# EasyEDA Pro project Inductive_displacement_sensor.epro

# Schematic Schematic1
Create Date: 2023-12-21; Page Name: P1; Project Name: sensor_coil; Schematic Name: Schematic1; Update Date: 2024-03-22; Company: 嘉立创EDA; Page Size: A4; Version: V1.0
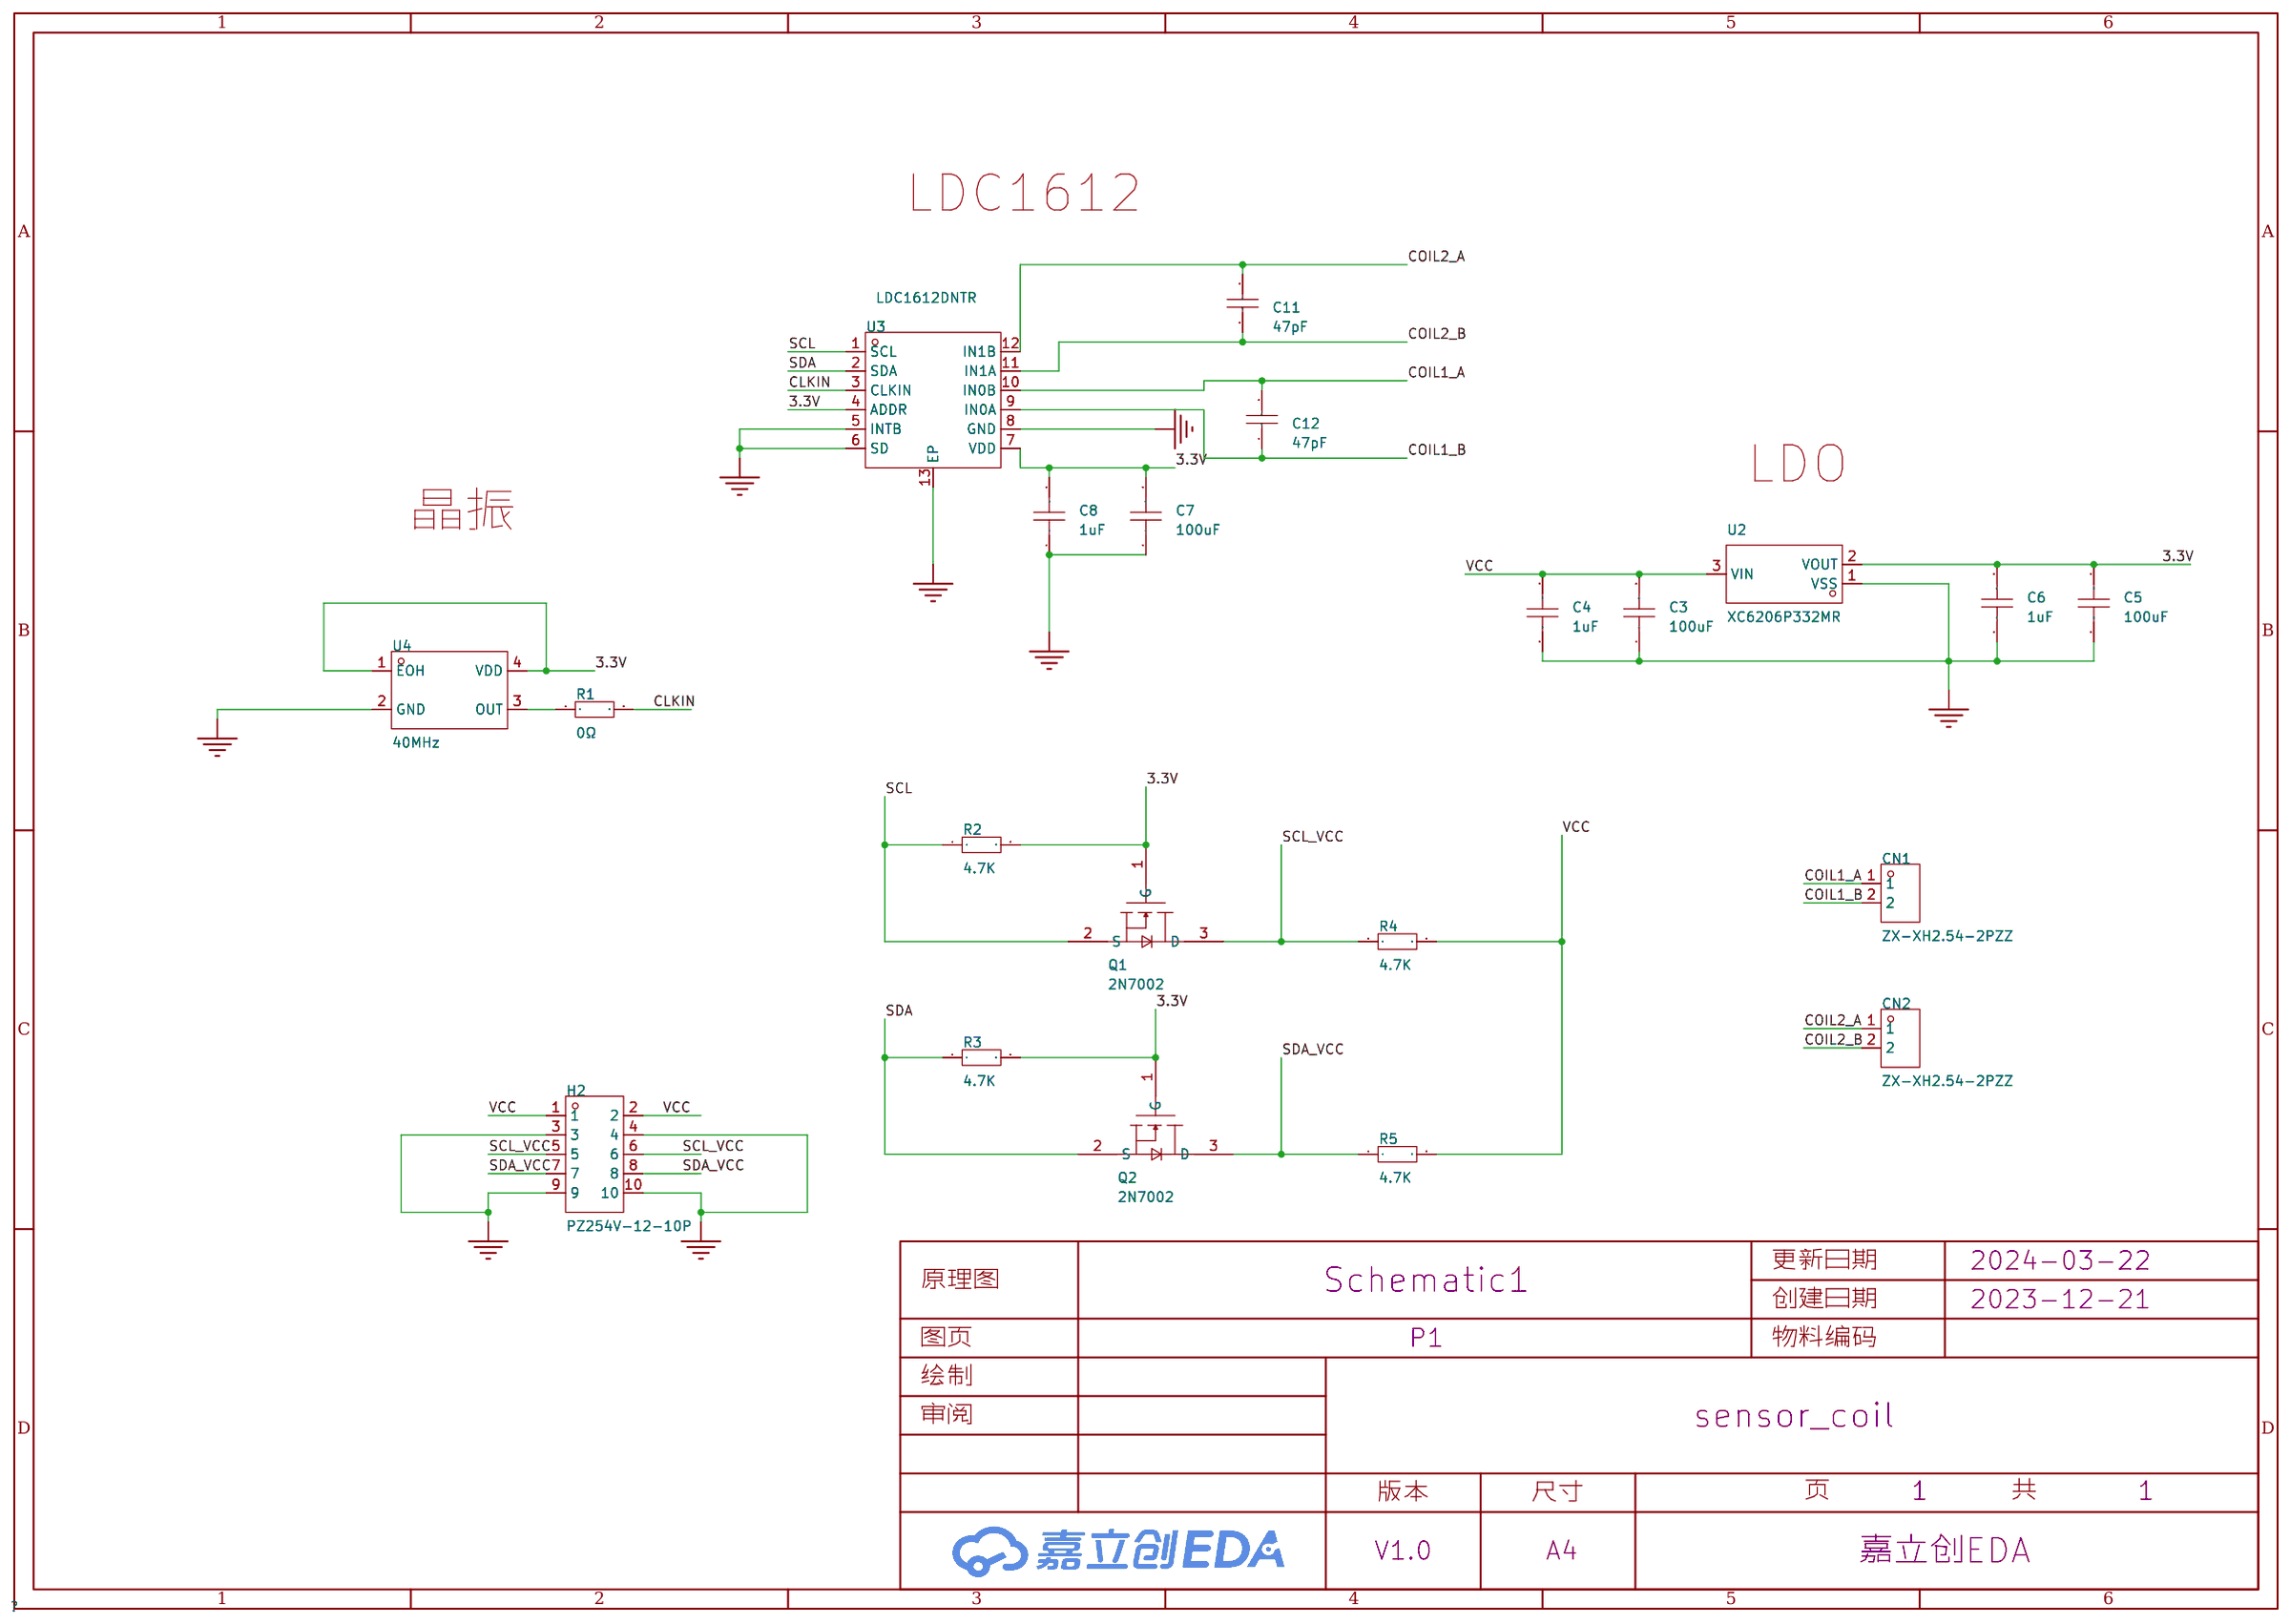
[diagram p0: schematic sheet]

## Parts
C3  100uF  [C0603]
C4  1uF  [C0603]
C5  100uF  [C0603]
C6  1uF  [C0603]
C7  100uF  [C0603]
C8  1uF  [C0603]
C11  47pF  [C0402]
C12  47pF  [C0402]
CN1  ZX-XH2.54-2PZZ  [CONN-TH_2P-P2.50_HX25003-2A]
CN2  ZX-XH2.54-2PZZ  [CONN-TH_2P-P2.50_HX25003-2A]
H2  PZ254V-12-10P  [HDR-TH_10P-P2.54-V-M-R2-C5-S2.54]
Q1  2N7002  [SOT-23-3_L2.9-W1.3-P1.90-LS2.4-BR]
Q2  2N7002  [SOT-23-3_L2.9-W1.3-P1.90-LS2.4-BR]
R1  0Ω  [R0603]
R2  4.7K  [R0603]
R3  4.7K  [R0603]
R4  4.7K  [R0603]
R5  4.7K  [R0603]
U2  XC6206P332MR  [SOT-23-3_L3.0-W1.7-P0.95-LS2.9-BR]
U3  LDC1612DNTR  [WSON-12_L4.0-W4.0-P0.50-BL-EP]
U4  40MHz  [OSC-SMD_4P-L2.5-W2.0-BL]

## Library data of the parts
C3-C8 = CAP_0603: Supplier Footprint: 0603
C11 C12 = 0402CG470J500NT: 容值:47pF;精度:±5%;额定电压:50V;材质(温度系数):C0G;; LCSC Part Name: 47pF ±5% 50V; Supplier Part: C1567; Manufacturer: FH(风华); Supplier Footprint: 0402; JLCPCB Part Class: 基础库; Datasheet: https://atta.szlcsc.com/upload/public/pdf/source/20200305/C486355_26A10D38EF8C2A5C37091D0039909270.pdf; Supplier: LCSC; Tolerance: ±5%; Voltage Rated: 50V; Temperature Coefficient: C0G
CN1 CN2 = ZX-XH2.54-2PZZ: 插针结构:1x2P;间距:2.54mm;安装方式:直插;参考系列:XH;总PIN数:2P;排数:1;每排PIN数:2;行距:-;额定电流:3A;触头材质:黄铜;触头镀层:锡;工作温度范围:-25℃~+85℃;; Supplier Part: C7429632; Manufacturer: Megastar(兆星); Supplier Footprint: 插件,P=2.54mm; JLCPCB Part Class: 扩展库; Datasheet: https://atta.szlcsc.com/upload/public/pdf/source/20230619/19BA6947230AA44A04D3EDD65E618FD0.pdf; Supplier: LCSC; Pins Structure: 1x2P; Pitch: 2.54mm; Mounting Style: 直插; Reference Series: XH; Number of Pins: 2P; Number of Rows: 1; Number of PINs Per Row: 2; Current Rating (Max): 3A; Contact Material: 黄铜; Contact Plating: 锡; Operating Temperature Range: -25℃~+85℃
H2 = PZ254V-12-10P: 插针结构:2x5P;间距:2.54mm;行距:2.54mm;圆针/方针:方针;安装类型:直插;排数:双排;总PIN位数:10P;额定电流:-;额定电压:-;配合针长度:6mm;塑高:2.5mm;端接针长度:3mm;触头材质:黄铜;触头镀层:-;工作温度范围:-40℃~+105℃;颜色:黑色;; LCSC Part Name: 间距:2.54mm 2x5P 直插 方针; Supplier Part: C492422; Manufacturer: XFCN(兴飞); Supplier Footprint: 插件,P=2.54mm; JLCPCB Part Class: 扩展库; Datasheet: https://atta.szlcsc.com/upload/public/pdf/source/20200309/C492422_5020CEA01BE7051F9EA9DD81AB0A25E3.pdf; Supplier: LCSC; Pin Structure: 2x5P; Pitch: 2.54mm; Row Spacing: 2.54mm; Circluar Pins/Square Pins: 方针; Mounting Type: 直插; Number of Rows: 双排; Number of Pins: 10P; Length of Mating Pin: 6mm; Insulation Height: 2.5mm; Length of End Connection Pin: 3mm; Contact Material: 黄铜; Operating Temperature Range: -40℃~+105℃; Color: 黑色
Q1 Q2 = 2N7002_C916396: 类型:N沟道;漏源电压(Vdss):60V;连续漏极电流(Id):115mA;功率(Pd):200mW;导通电阻(RDS(on)@Vgs,Id):1.2Ω@10V,500mA;阈值电压(Vgs(th)@Id):2.1V@250uA;; LCSC Part Name: N沟道 耐压:60V 电流:115mA; Supplier Part: C916396; Manufacturer: JSMSEMI(杰盛微); Supplier Footprint: SOT-23; JLCPCB Part Class: 扩展库; Datasheet: https://atta.szlcsc.com/upload/public/pdf/source/20230714/89F30C6A193AD72E5F1F14B53E304F4A.pdf; Supplier: LCSC; Type: N沟道; Drain Source Voltage (Vdss): 60V; Continuous Drain Current (Id): 115mA; Power Dissipation (Pd): 200mW; Drain Source On Resistance (RDS(on)@Vgs,Id): 1.2Ω@10V,500mA; Gate Threshold Voltage (Vgs(th)@Id): 2.1V@250uA; Input Capacitance (Ciss@Vds): 20pF@25V; Reverse Transfer Capacitance (Crss@Vds): 4pF@25V
R1-R5 = Res_0603: Supplier Footprint: 0603
U2 = XC6206P332MR_C347376: 输出类型:固定;最大输入电压:8V;输出电压:3.3V;最大输出电流:250mA;电源纹波抑制比(PSRR):40dB@(1kHz);输出极性:正极;; LCSC Part Name: 输入8V 输出3.3V 250mA; Supplier Part: C347376; Manufacturer: UMW(友台半导体); Supplier Footprint: SOT-23; JLCPCB Part Class: 扩展库; Datasheet: https://atta.szlcsc.com/upload/public/pdf/source/20231109/6B10DA60E52FC900BF97E3EFEB5D6341.pdf; Supplier: LCSC; Output Type: 固定; Maximum Input Voltage: 8V; Output Voltage: 3.3V; MAX Output Current: 250mA; Power Supply Rejection Ratio (PSRR): 40dB@(1kHz); Dropout Voltage: 240mV@(50mA); Operating Temperature: -25℃~+80℃; Output Polarity: 正极; Number of Outputs: 1
U3 = LDC1612DNTR: LDC1612 2 通道、28 位、高分辨率电感数字转换器; Supplier Part: C1847959; Manufacturer: TI(德州仪器); Supplier Footprint: WSON-12-EP(4x4); JLCPCB Part Class: 扩展库; Datasheet: https://www.ti.com/cn/lit/gpn/ldc1614; Supplier: LCSC
U4 = 625L3C040M00000: 频率:40MHz;输出模式:CMOS;工作电压:3.3V;供电电流:15mA;频率稳定度(全温):±50ppm;; Supplier Part: C2650709; Manufacturer: CTS(西迪斯); Supplier Footprint: SMD2520-4P; JLCPCB Part Class: 扩展库; Datasheet: https://atta.szlcsc.com/upload/public/pdf/source/20210610/B2972916CDAADDBBA22F3051322CA2A0.pdf; Supplier: LCSC; Output Type: CMOS; Supply Voltage: 3.3V; Supply Current (Max): 15mA; Frequency Stability(Full temperature range): ±50ppm; Operating Temperature: -20℃~+70℃

## Nets
3.3V: C5.2 C6.2 C7.2 C8.2 Q1.1(G) Q2.1(G) R2.2 R3.2 U2.2(VOUT) U3.4(ADDR) U3.7(VDD) U4.1(EOH) U4.4(VDD)
GND: C3.1 C4.1 C5.1 C6.1 C7.1 C8.1 H2.3 H2.4 H2.9 H2.10 U2.1(VSS) U3.5(INTB) U3.6(SD) U3.8(GND) U3.13(EP) U4.2(GND)
VCC: C3.2 C4.2 H2.1 H2.2 R4.2 R5.2 U2.3(VIN)
CLKIN: R1.2 U3.3(CLKIN)
COIL1_A: C12.2 CN1.1 U3.10(IN0B)
COIL1_B: C12.1 CN1.2 U3.9(IN0A)
COIL2_A: C11.2 CN2.1 U3.12(IN1B)
COIL2_B: C11.1 CN2.2 U3.11(IN1A)
SCL: Q1.2(S) R2.1 U3.1(SCL)
SCL_VCC: H2.5 H2.6 Q1.3(D) R4.1
SDA: Q2.2(S) R3.1 U3.2(SDA)
SDA_VCC: H2.7 H2.8 Q2.3(D) R5.1
$1N1491: R1.1 U4.3(OUT)

## Notes on the sheet
- LDC1612
- LDO
- 晶振

# Board PCB1
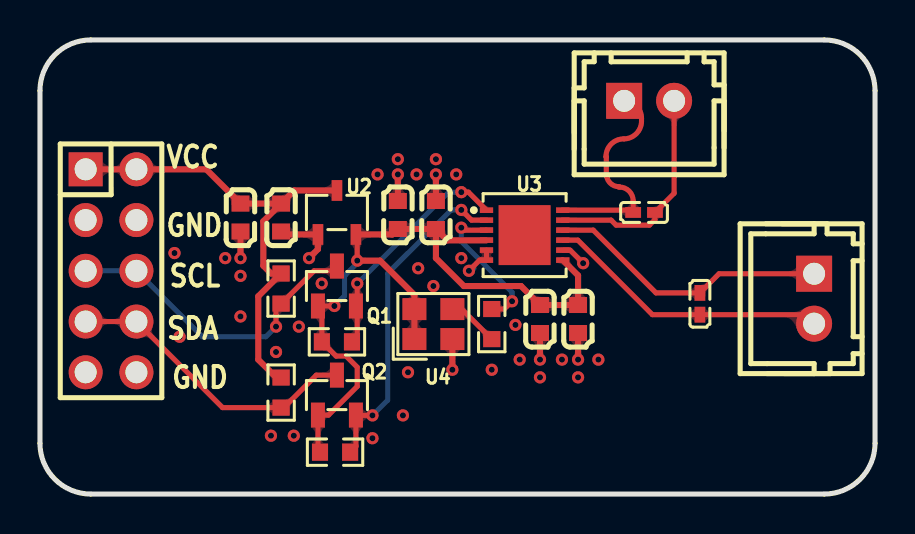
[diagram p1: board, top side]
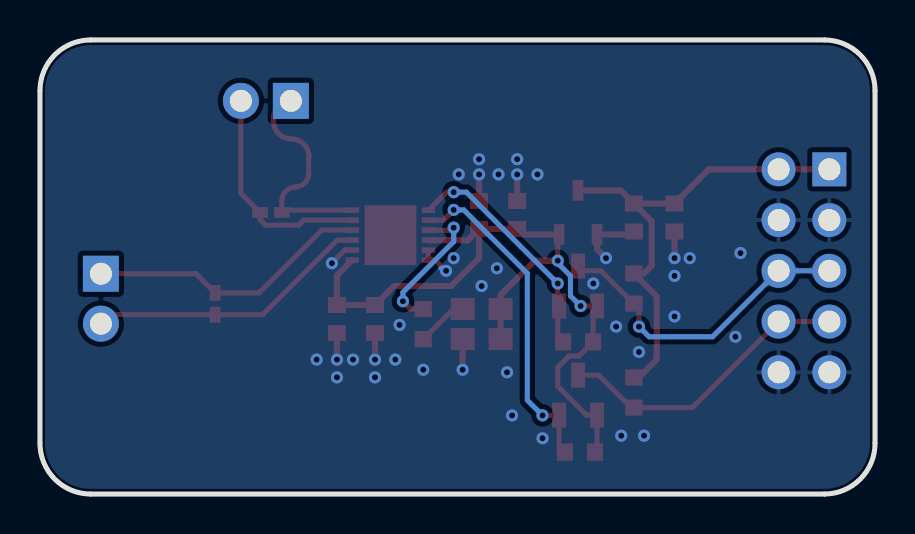
[diagram p2: board, bottom side, seen from below]

Outline 41.78 x 22.73 mm; copper layers: Top Layer, Bottom Layer. Coordinates in mm from the lower left corner of the outline.
Outline path: 0,20.19 0,2.54 arc(0.74,0.74) 2.54,0 39.24,0 arc(41.04,0.74) 41.78,2.54 41.78,20.19 arc(41.04,21.99) 39.24,22.73 2.54,22.73 arc(0.74,21.99) 0,20.19
Stack: Top Layer 0.035mm - / Dielectric1 1.51mm FR4 er 4.5 / Bottom Layer 0.035mm -

## Design rules (mm)
net SCL: DP3
net SDA: DP3
net COIL2_A: DP1
net COIL2_B: DP1
net COIL1_A: DP4
net COIL1_B: DP4
net SCL_VCC: DP2
net SDA_VCC: DP2
template: JLCPCB Capability(Two Layers Board)
spacing copperThickness1oz (default): track to track 0.102, other pairs 0.152 to 0.3
spacing copperThickness2oz: track to track 0.203, other pairs 0.152 to 0.3
track width copperThickness1oz (default): min 0.127, default 0.254, max 2.54
track width copperThickness2oz: min 0.203, default 0.254, max 2.54
differential pair differentialPair (default): width min 0.127, default 0.254, max 2.54; gap min 0.152, default 0.152
via viaSize (default): diameter min 0.5, default 0.61, max 10; hole min 0.3, default 0.305, max 6.3

## Placement (name value [footprint] x y rotation side)
C3  100uF  [C0603]  12.06 13.84 90 top
C4  1uF  [C0603]  10.03 13.84 90 top
C5  100uF  [C0603]  19.81 13.97 270 top
C6  1uF  [C0603]  17.91 13.97 270 top
C7  100uF  [C0603]  25.02 8.76 90 top
C8  1uF  [C0603]  26.92 8.76 90 top
C11  47pF  [C0402]  30.23 14.1 180 top
C12  47pF  [C0402]  33.02 9.53 90 top
CN1  ZX-XH2.54-2PZZ  [CONN-TH_2P-P2.50_HX25003-2A]  38.73 9.78 270 top
CN2  ZX-XH2.54-2PZZ  [CONN-TH_2P-P2.50_HX25003-2A]  30.48 19.69 0 top
H2  PZ254V-12-10P  [HDR-TH_10P-P2.54-V-M-R2-C5-S2.54]  3.56 11.18 270 top
Q1  2N7002  [SOT-23-3_L2.9-W1.3-P1.90-LS2.4-BR]  14.86 10.41 270 top
Q2  2N7002  [SOT-23-3_L2.9-W1.3-P1.90-LS2.4-BR]  14.86 4.95 270 top
R1  0Ω  [R0603]  22.61 8.51 90 top
R2  4.7K  [R0603]  14.86 7.62 180 top
R3  4.7K  [R0603]  14.76 2.1 180 top
R4  4.7K  [R0603]  12.06 10.29 90 top
R5  4.7K  [R0603]  12.06 5.08 90 top
U2  XC6206P332MR  [SOT-23-3_L3.0-W1.7-P0.95-LS2.9-BR]  14.86 14.1 270 top
U3  LDC1612DNTR  [WSON-12_L4.0-W4.0-P0.50-BL-EP]  24.25 12.96 270 top
U4  40MHz  [OSC-SMD_4P-L2.5-W2.0-BL]  19.69 8.51 0 top

## Footprints (pads in the part's own frame, mm; a bottom-side part is the same pattern mirrored in y, then rotated)
C0402
  rect 0.79x0.54 smd: 1(-0.545,0) 2(0.545,0)
C0603
  rect 0.8x0.9 smd: 1(-0.7,0) 2(0.7,0)
CONN-TH_2P-P2.50_HX25003-2A
  rect 1.8x1.8 hole 1.1: 1(-1.25,0)
  round 1.8 hole 1.1: 2(1.25,0)
HDR-TH_10P-P2.54-V-M-R2-C5-S2.54
  rect 1.7x1.7 hole 1.1: 1(-5.08,-1.27)
  round 1.7 hole 1.1: 2(-5.08,1.27) 3(-2.54,-1.27) 4(-2.54,1.27) 5(0,-1.27) 6(0,1.27) 7(2.54,-1.27) 8(2.54,1.27) 9(5.08,-1.27) 10(5.08,1.27)
OSC-SMD_4P-L2.5-W2.0-BL
  rect 1.2x1.1 smd: 1(-0.95,-0.75) 2(0.95,-0.75) 3(0.95,0.75) 4(-0.95,0.75)
R0603
  rect 0.806x0.864 smd: 1(-0.753,0) 2(0.753,0)
SOT-23-3_L2.9-W1.3-P1.90-LS2.4-BR
  rect 1.25x0.7 smd: 1(1,-0.95) 2(1,0.95) 3(-1,0)
SOT-23-3_L3.0-W1.7-P0.95-LS2.9-BR
  rect 1.038x0.532 smd: 1(1.101,-0.95) 2(1.101,0.95) 3(-1.101,0)
WSON-12_L4.0-W4.0-P0.50-BL-EP
  rect 0.28x0.665 smd: 1(-1.25,-1.907) 2(-0.75,-1.907) 3(-0.25,-1.907) 4(0.25,-1.907) 5(0.75,-1.907) 6(1.25,-1.907) 7(1.25,1.907) 8(0.75,1.907) 9(0.25,1.907) 10(-0.25,1.907) 11(-0.75,1.907) 12(-1.25,1.907)
  rect 3x2.6 smd: 13(0,0)

## Nets
As in the schematic.

## Via types
v1: diameter 0.61, hole 0.305, Top Layer to Bottom Layer, 46 vias

## Routing (per net, layer and track width the routed paths; a pad name or vN(x,y) marks a point on that pad's centre or on a via; arc(x,y) is an arc through that point)
3.3V: length 39.3
  Top Layer w0.254: v1(14.73,9.41) Q1.1 14.11,9.22 R2.2 14.82,6.91 15.32,6.91 15.88,6.35 15.88,5.39 14.44,3.95 Q2.1 13.91,2.2 R3.2 ; U2.2 15.88,12.93 v1(15.88,11.68)
  Top Layer w0.305: U3.7 26.92,10.94 C8.2 C7.2 24.07,10.41 21.21,10.41 19.81,11.81 19.81,13.27 ; U4.1 U4.4 18.73,9.97 17.02,11.68 v1(15.88,11.68) ; 19.81,13.27 20.38,12.7 22.33,12.7 ; 19.81,13.27 17.91,13.27 17.63,13 U2.2
  Bottom Layer w0.254: v1(15.88,11.68) 15.88,11.56 15.24,10.92 15.24,9.92 v1(14.73,9.41)
GND: length 14.7
  Top Layer w0.254: U3.8 26.52,12.21 v1(27.18,11.56) ; v1(21.46,11.18) 22,11.71 U3.6 U3.5
  Top Layer w0.305: U4.2 v1(20.63,6.22) ; v1(13.46,11.81) 13.91,12.26 U2.1 12.21,13 C3.1 ; C8.1 v1(26.92,6.73) ; v1(10.03,11.81) C4.1 ; v1(25.02,6.73) C7.1 ; v1(19.81,16) C5.1 ; v1(17.91,16) C6.1
  Bottom Layer w0.254: 21.72,11.3 21.59,11.18 v1(21.46,11.18)
  Bottom Layer w0.305: v1(20.63,6.22) 20.57,6.22
  vias: v1(6.73,12.06) v1(6.98,7.87) v1(9.27,11.81) v1(10.03,10.92) v1(10.03,8.89) v1(11.56,2.92) v1(11.81,7.11) v1(12.7,2.92) v1(12.95,8.38) v1(14.1,10.54) v1(16.64,2.79) v1(16.89,16) v1(17.91,16.76) v1(18.16,3.94) v1(18.41,6.1) v1(18.84,16) v1(18.92,11.3) v1(19.69,10.41) v1(19.81,16.76) v1(20.83,16) v1(21.08,11.81) v1(22.61,6.22) v1(23.79,8.47) v1(24,6.73) v1(25.02,5.84) v1(26.12,6.73) v1(26.92,5.84) v1(27.94,6.73)
VCC: length 24.4
  Top Layer w0.305: U2.3 12.72,15.2 C3.2 ; R5.2 11.82,5.83 10.92,6.73 10.92,9.9 R4.2 11.57,11.04 11.18,11.43 11.18,13.65 C3.2 ; C3.2 C4.2 8.32,16.26 H2.2 2.29,16.26
CLKIN: length 7.2
  Top Layer w0.254: v1(23.62,9.65) 23.23,9.26 R1.2 ; U3.3 22.34,13.21 21.21,13.21 v1(21.08,13.34)
  Bottom Layer w0.254: v1(21.08,13.34) 21.08,12.64 23.62,10.1 v1(23.62,9.65)
COIL1_A: length 14.3
  Top Layer w0.254: CN1.1 33.98,11.03 C12.2 30.82,10.07 27.68,13.21 U3.10
COIL1_B: length 14.3
  Top Layer w0.254: CN1.2 38.28,8.98 C12.1 30.64,8.98 26.91,12.71 U3.9
COIL2_A: length 11.3
  Top Layer w0.254: C11.2 29.68,14.68 arc(29.48,15.17) 29,15.37 28.96,15.37 ; 28.32,16 28.34,16.02 28.34,16.88 28.32,16.89 arc(28.58,17.52) 29.21,17.78 arc(29.84,18.04) 30.1,18.67 30.1,18.82 arc(29.84,19.43) CN2.1 ; U3.12 29.57,14.21 ; 28.98,15.39 arc(28.53,15.57) 28.34,16.02
COIL2_B: length 11.2
  Top Layer w0.254: CN2.2 31.73,15.06 C11.1 30.77,13.74 30.5,13.46 28.83,13.46 28.58,13.71 U3.11
SCL: length 11.8
  Top Layer w0.254: U3.1 21.44,15.11 v1(21.08,15.11) ; R2.1 15.88,7.88 v1(15.88,10.54)
  Bottom Layer w0.254: v1(15.88,10.54) 20.45,15.11 v1(21.08,15.11)
SCL_VCC: length 15.9
  Top Layer w0.254: 12.07,9.53 13.72,11.18 14.62,11.18 Q1.3 ; 12.07,9.53 11.81,9.27 v1(11.81,8.38) ; 12.07,9.53 R4.1
  Bottom Layer w0.254: 2.29,11.18 H2.6 8.13,7.87 11.3,7.87 v1(11.81,8.38)
SDA: length 16.7
  Top Layer w0.254: R3.1 15.81,2.39 Q2.2 15.82,3.94 v1(16.64,3.94) ; v1(21.08,14.22) 21.59,13.71 U3.2
  Bottom Layer w0.254: v1(16.64,3.94) 17.4,4.7 17.4,11.05 20.57,14.22 v1(21.08,14.22)
SDA_VCC: length 15
  Top Layer w0.254: 2.29,8.64 H2.8 9.14,4.33 R5.1 12.2,4.33 13.83,5.95 Q2.3
$1N1491: length 2.6
  Top Layer w0.254: U4.3 21.1,9.26 R1.1

## Copper pours and planes (outline as drawn; the poured copper is in the pictures)
GND on Top Layer: -0.25,23.37 41.78,23.37 41.78,-0.25 -0.25,-0.25
GND on Bottom Layer: -1.78,25.02 43.69,25.02 43.69,-2.41 -1.78,-2.41

Small or netless copper shapes (teardrops, artwork), in the pictures only: 102 on Top Layer, 12 on Bottom Layer

## Text on the board
Top Silkscreen Layer: VCC | GND | SDA | SCL
